# Altium schematic sheet 2_P1_mic_amp_debug.schdoc
size 307 x 218 mm; Symbol: Sheet-Symbol_A4; Device: Sheet-Symbol_A4; @Project Name: modular_design; @Page Count: 7; @Update Date: 2026-07-07; @Create Date: 2026-06-24; @Schematic Name: Schematic1; @Page No: 2; @Page Name: P1_mic_amp_debug; @Board Name: Board1; Company: 嘉立创EDA; Version: V1.0; Page Size: A4; Convert to PCB: yes; Add into BOM: yes; Title Block Position: 3; Width: 1170; Height: 825; Region Start: 1; X Region Count: 6; Y Region Count: 4; Blade Width: 10; @Create Time: 08:20:49; @Update Time: 15:13:21
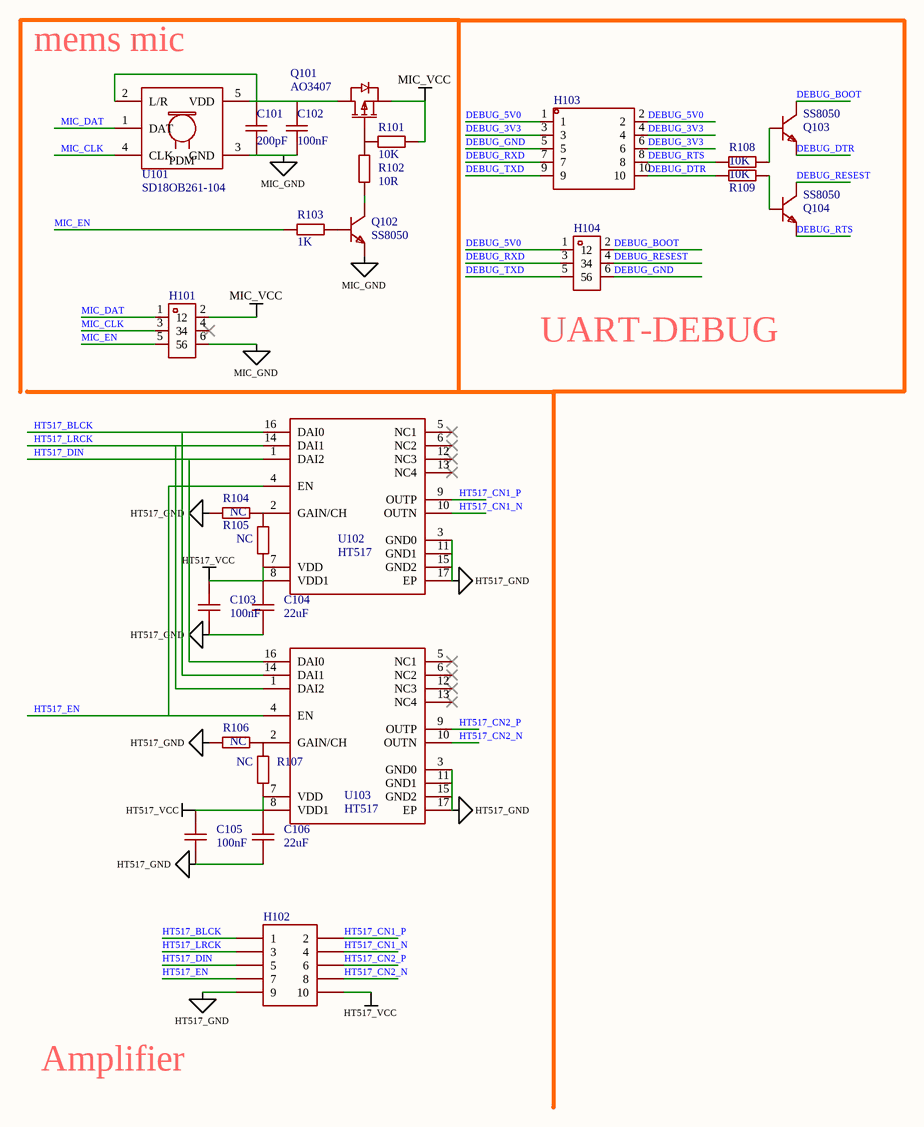
[diagram p0: 2_P1_mic_amp_debug.schdoc]

## Parts
C101  200pF  [C0603]
C102  100nF  [C0603]
C103  100nF  [C0805]
C104  22uF  [C0805]
C105  100nF  [C0805]
C106  22uF  [C0805]
H101  PZ254V-12-6P  [Finger_2*3]  (value not drawn)
H102  (no value)  [Finger_2*5]
H103  MTP125-1205S1  [HDR-TH_10P-P2.54-V-M-R2-C5-S2.54]  (value not drawn)
H104  PZ254V-12-6P  [Finger_2*3]  (value not drawn)
Q101  AO3407  [SOT-23-3_L2.9-W1.3-P1.90-LS2.4-BR]
Q102  SS8050  [SOT-23-3_L2.9-W1.3-P1.90-LS2.4-BR]
Q103  SS8050  [SOT-23-3_L2.9-W1.3-P1.90-LS2.4-BR]
Q104  SS8050  [SOT-23-3_L2.9-W1.3-P1.90-LS2.4-BR]
R101  10K  [R0603]
R102  10R  [R0603]
R103  1K  [R0603]
R104  NC  [R0603]
R105  NC  [R0603]
R106  NC  [R0603]
R107  NC  [R0603]
R108  10K  [R0603]
R109  10K  [R0603]
U101  (no value)  [SD18OB261-104]
U102  HT517  [QFN-16_L3.0-W3.0-P0.50-TL-EP1.7]
U103  HT517  [QFN-16_L3.0-W3.0-P0.50-TL-EP1.7]

## Nets
HT517_GND: C103.1 C104.1 C105.1 C106.1 H102.9 R104.2 R106.2 U102.3(GND0) U102.11(GND1) U102.15(GND2) U102.17(EP) U103.3(GND0) U103.11(GND1) U103.15(GND2) U103.17(EP)
HT517_VCC: C103.2 C104.2 C105.2 C106.2 H102.10 R105.2 R107.2 U102.7(VDD) U102.8(VDD1) U103.7(VDD) U103.8(VDD1)
MIC_GND: C101.1 C102.1 H101.6 Q102.2(E) U101.3(GND)
MIC_VCC: H101.2 Q101.2(S) R101.2
DEBUG_3V3: H103.3 H103.4 H103.6
DEBUG_5V0: H103.1 H103.2 H104.1
DEBUG_BOOT: H104.2 Q103.3(C)
DEBUG_DTR: H103.10 Q103.2(E) R109.1
DEBUG_GND: H103.5 H104.6
DEBUG_RESEST: H104.4 Q104.3(C)
DEBUG_RTS: H103.8 Q104.2(E) R108.1
DEBUG_RXD: H103.7 H104.3
DEBUG_TXD: H103.9 H104.5
HT517_BLCK: H102.1 U102.16(DAI0) U103.14(DAI1)
HT517_CN1_N: H102.4 U102.10(OUTN)
HT517_CN1_P: H102.2 U102.9(OUTP)
HT517_CN2_N: H102.8 U103.10(OUTN)
HT517_CN2_P: H102.6 U103.9(OUTP)
HT517_DIN: H102.5 U102.1(DAI2) U103.16(DAI0)
HT517_EN: H102.7 U102.4(EN) U103.4(EN)
HT517_LRCK: H102.3 U102.14(DAI1) U103.1(DAI2)
MIC_CLK: H101.3 U101.4(CLK)
MIC_DAT: H101.1 U101.1(DAT)
MIC_EN: H101.5 R103.2
NetC101_2: C101.2 C102.2 Q101.3(D) U101.2(L/R) U101.5(VDD)
NetQ101_1: Q101.1(G) R101.1 R102.2
NetQ102_1: Q102.1(B) R103.1
NetQ102_3: Q102.3(C) R102.1
NetQ103_1: Q103.1(B) R108.2
NetQ104_1: Q104.1(B) R109.2
NetR104_1: R104.1 R105.1 U102.2(GAIN/CH)
NetR106_1: R106.1 R107.1 U103.2(GAIN/CH)

Not connected (* = marked no-connect by the designer): H101 4*; U102 5(NC1)* 6(NC2)* 12(NC3)* 13(NC4)*; U103 5(NC1)* 6(NC2)* 12(NC3)* 13(NC4)*

## Notes on the sheet
- (near U101) mems mic
- (near H104) UART-DEBUG
- Amplifier
- 1
- 2
- 3
- 4
- 5
- 6
- A
- B
- C
- 原理图
- Schematic1
- 创建日期
- 更新日期
- 2026-06-24
- 2026-07-07
- 绘制
- 板子
- Board1
- 图页
- P1_mic_amp_debug
- D
- 审阅
- 版本
- 尺寸
- modular_design
- 页
- 共
- 7
- V1.0
- A4
- 嘉立创EDA
- (in symbol SD18OB261-104) PDM

## Library data of the parts
C101 = CAP_0603: Symbol: CapAcitance; Convert to PCB: yes; Value: 100nF; Device: CAP_0603; Add into BOM: yes; Supplier Footprint: 0603
C102 = CAP_0603: Symbol: CapAcitance; Convert to PCB: yes; Device: CAP_0603; Add into BOM: yes; Supplier Footprint: 0603; Value: 100nF
C103 C105 = CAP_0603: Convert to PCB: yes; Origin Footprint: C0603; Symbol: CAP_0603; Device: CAP_0603; Add into BOM: yes; Supplier Footprint: 0603; Value: 100nF
C104 C106 = CAP_0603: Convert to PCB: yes; Value: 100nF; Origin Footprint: C0603; Symbol: CAP_0603; Device: CAP_0603; Add into BOM: yes; Supplier Footprint: 0603
H101 H104 = PZ254V-12-6P: Manufacturer: XFCN(兴飞); Add into BOM: yes; Pitch: 2.54mm; Pin Structure: 2x3P; Circluar Pins/Square Pins: 方针; Symbol: PZ254V-12-6P; Device: PZ254V-12-6P; LCSC Part Name: 2.54mm 2x3P 直插 方针; Supplier Part: C492420; Manufacturer Part: PZ254V-12-6P; Supplier Footprint: 插件,P=2.54mm; JLCPCB Part Class: Extended Part; Datasheet: https://atta.szlcsc.com/upload/public/pdf/source/20200309/C492420_BAECB307B001054C09D200388220EAE6.pdf; Supplier: LCSC; Convert to PCB: yes; Number of Pins: 6; Number of Rows: 2; Row Spacing: 2.54mm; Mounting Type: 直插; Current Rating (Max): -; Voltage Rating (Max): -; Length of Mating Pin: 6mm; Insulation Height: 2.5mm; Length of End Connection Pin: 3mm; Contact Material: 黄铜; Contact Plating: -; Operating Temperature Range: -40℃~+105℃; Color: 黑色
H102 = Finger_2*5: Add into BOM: yes; Symbol: Finger_2*5; Device: Finger_2*5; Convert to PCB: yes
H103 = MTP125-1205S1: Manufacturer: MINTRON(明硕); Add into BOM: yes; Pitch: 2.54mm; Pin Structure: 2x5P; Circluar Pins/Square Pins: 方针; Symbol: MTP125-1205S1; Device: MTP125-1205S1; LCSC Part Name: 2.54mm 2x5P 直插 方针; Supplier Part: C358694; Manufacturer Part: MTP125-1205S1; Supplier Footprint: 直插,P=2.54mm; JLCPCB Part Class: Extended Part; Datasheet: https://atta.szlcsc.com/upload/public/pdf/source/20190124/C358694_E064CA5513580D5D1E2D2AA5B37BD31F.pdf; Supplier: LCSC; Convert to PCB: yes; Number of Pins: 10; Number of Rows: 2; Row Spacing: 2.54mm; Mounting Type: 直插; Current Rating (Max): -; Voltage Rating (Max): -; Length of Mating Pin: 6mm; Insulation Height: 2.5mm; Length of End Connection Pin: 3mm; Contact Material: 黄铜; Contact Plating: -; Operating Temperature Range: -40℃~+105℃; Color: 黑色
Q101 = AO3407: Manufacturer: MDD; Symbol: AO3407_C427386; Add into BOM: yes; Type: P沟道; Drain Source Voltage (Vdss): 30V; Continuous Drain Current (Id): 4.1A; Power Dissipation (Pd): 1.2W; Drain Source On Resistance (RDS(on)@Vgs,Id): 43mΩ@10V,4A; Gate Threshold Voltage (Vgs(th)@Id): 1.6V@250uA; Total Gate Charge (Qg@Vgs): 8.2nC@10V; Input Capacitance (Ciss@Vds): 493pF@15V; Reverse Transfer Capacitance (Crss@Vds): 44pF@15V; Device: AO3407; LCSC Part Name: P沟道 30V 4.1A; Supplier Part: C427386; Manufacturer Part: AO3407; Supplier Footprint: SOT-23; JLCPCB Part Class: Extended Part; Datasheet: https://atta.szlcsc.com/upload/public/pdf/source/20200323/C427386_85D7E7823FFE65CD958D58FA92E0A192.pdf; Supplier: LCSC; Convert to PCB: yes; Operating Temperature: +150℃@(Tj)
Q102 = SS8050: Manufacturer: CJ（江苏长电/长晶）; Symbol: SS8050_C2150; Add into BOM: yes; Transistor Type: NPN; Collector-Emitter Breakdown Voltage (Vceo): 25V; Collector Current (Ic): 1.5A; Power Dissipation (Pd): 300mW; Collector-Emitter Saturation Voltage (VCE(sat)@Ic,Ib): 500mV@800mA,80mA; DC Current Gain (hFE@Ic,Vce): 200@100mA,1V; Transition Frequency (fT): 100MHz; Device: SS8050; LCSC Part Name: SS8050 Y1 200-350 Y1 200-350; Supplier Part: C2150; Manufacturer Part: SS8050; Supplier Footprint: SOT-23(SOT-23-3); JLCPCB Part Class: Basic Part; Datasheet: https://atta.szlcsc.com/upload/public/pdf/source/20140809/1457707209319.pdf; Supplier: LCSC; Convert to PCB: yes; Operating Temperature: +150℃@(Tj)
Q103 Q104 = SS8050: Manufacturer: CJ（江苏长电/长晶）; Add into BOM: yes; Transistor Type: NPN; Collector-Emitter Breakdown Voltage (Vceo): 25V; Collector Current (Ic): 1.5A; Power Dissipation (Pd): 300mW; Collector-Emitter Saturation Voltage (VCE(sat)@Ic,Ib): 500mV@800mA,80mA; DC Current Gain (hFE@Ic,Vce): 200@100mA,1V; Transition Frequency (fT): 100MHz; Symbol: SS8050; Device: SS8050; LCSC Part Name: SS8050 Y1 200-350 Y1 200-350; Supplier Part: C2150; Manufacturer Part: SS8050; Supplier Footprint: SOT-23(SOT-23-3); JLCPCB Part Class: Basic Part; Datasheet: https://atta.szlcsc.com/upload/public/pdf/source/20140809/1457707209319.pdf; Supplier: LCSC; Convert to PCB: yes; Operating Temperature: +150℃@(Tj); Origin Footprint: SOT-23-3_L2.9-W1.3-P1.90-LS2.4-BR
R101-R103 = Res_0603: Symbol: 电阻; Convert to PCB: yes; Device: Res_0603; Add into BOM: yes; Supplier Footprint: 0603
  R101: Value: 10K
  R102: Value: 10R
  R103: Value: 1K
R104-R107 = 0805W8F1002T5E_C17414: Manufacturer: UNI-ROYAL(厚声); Add into BOM: yes; Tolerance: ±1%; Power(Watts): 125mW; Overload Voltage (Max): 150V; Temperature Coefficient: ±100ppm/℃; Origin Footprint: R0805; Symbol: 0805W8F1002T5E_C17414; Device: 0805W8F1002T5E_C17414; Supplier: LCSC; Manufacturer Part: 0805W8F1002T5E; Value: NC; JLCPCB Part Class: Basic Part; LCSC Part Name: 10kΩ ±1% 125mW 厚膜电阻; Supplier Footprint: 0805; Datasheet: https://atta.szlcsc.com/upload/public/pdf/source/20200306/C422600_1E6D84923E4A46A82E41ADD87F860B5C.pdf; Convert to PCB: yes; Type: 厚膜电阻; Operating Temperature Range: -55℃~+155℃
R108 R109 = 0805W8F1002T5E_C17414: Manufacturer: UNI-ROYAL(厚声); Value: NC; Add into BOM: yes; Tolerance: ±1%; Power(Watts): 125mW; Overload Voltage (Max): 150V; Temperature Coefficient: ±100ppm/℃; Origin Footprint: R0805; Symbol: 0805W8F1002T5E_C17414; Device: 0805W8F1002T5E_C17414; Supplier: LCSC; Manufacturer Part: 0805W8F1002T5E; JLCPCB Part Class: Basic Part; LCSC Part Name: 10kΩ ±1% 125mW 厚膜电阻; Supplier Footprint: 0805; Datasheet: https://atta.szlcsc.com/upload/public/pdf/source/20200306/C422600_1E6D84923E4A46A82E41ADD87F860B5C.pdf; Convert to PCB: yes; Type: 厚膜电阻; Operating Temperature Range: -55℃~+155℃
U101 = SD18OB261-104: Add into BOM: yes; Symbol: SD18OB261-104; Device: SD18OB261-104; Convert to PCB: yes
U102 U103 = HT517: Add into BOM: yes; Symbol: HT517; Device: HT517; Convert to PCB: yes; Origin Footprint: QFN-16_L3.0-W3.0-P0.50-TL-EP1.7